# Altium schematic sheet DCDC35V.SchDoc
size 420 x 297 mm; SheetNumber: 6; SheetTotal: 8
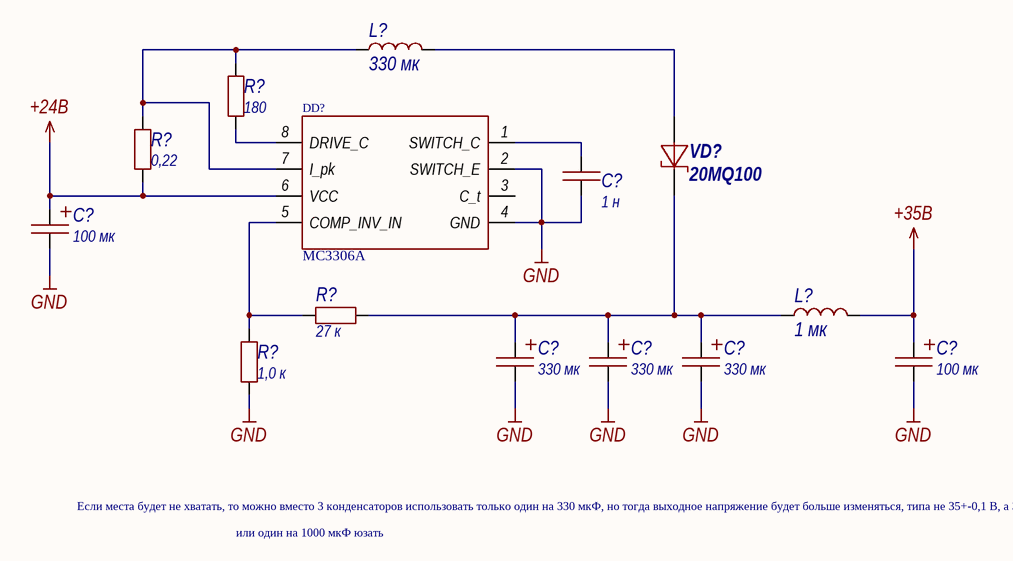
[diagram p0: DCDC35V.SchDoc]

## Parts
(Parts that share a designator on the sheet are numbered #1, #2 ... from top to bottom, then left to right.)
C?#1  value 1 н  [0603C]  (hidden comment: Capacitor)
C?#2  value 100 мк  [ECAP_SMD_6,6x6,6]  (hidden comment: Capacitor)
C?#3  value 330 мк  [ECAP_SMD_10,3x10,3]  (hidden comment: Capacitor)
C?#4  value 330 мк  [ECAP_SMD_10,3x10,3]  (hidden comment: Capacitor)
C?#5  value 330 мк  [ECAP_SMD_10,3x10,3]  (hidden comment: Capacitor)
C?#6  value 100 мк  [ECAP_SMD_6,6x6,6]  (hidden comment: Capacitor)
DD?  MC3306A  [SOIC-8]
L?#1  value 330 мк  [12.8x12.8]  (hidden comment: CDSPRH127-331M)
L?#2  value 1 мк  [4.5x4_wired]  (hidden comment: CDSP43-1R0M)
R?#1  value 0,22  [2512R]  (hidden comment: Resistor)
R?#2  value 180  [0603R]  (hidden comment: Resistor)
R?#3  value 27 к  [0603R]  (hidden comment: Resistor)
R?#4  value 1,0 к  [0603R]  (hidden comment: Resistor)
VD?  20MQ100  [SMA]

## Nets
+24В: C?#2.1 DD?.6(VCC) R?#1.2
+35В: C?#6.1 L?#2.2
GND: C?#1.1 C?#2.2 C?#3.2 C?#4.2 C?#5.2 C?#6.2 DD?.2(SWITCH_E) DD?.4(GND) R?#4.1
NetC?#1_2: C?#1.2 DD?.1(SWITCH_C)
NetC?#3_1: C?#3.1 C?#4.1 C?#5.1 L?#2.1 R?#3.2 VD?.2
NetDD?_5: DD?.5(COMP_INV_IN) R?#3.1 R?#4.2
NetDD?_7: DD?.7(I_pk) L?#1.1 R?#1.1 R?#2.2
NetDD?_8: DD?.8(DRIVE_C) R?#2.1
NetL?#1_2: L?#1.2 VD?.1

Not connected (* = marked no-connect by the designer): DD? 3(C_t)

## Notes on the sheet
- Если места будет не хватать, то можно вместо 3 конденсаторов использовать только один на 330 мкФ, но тогда выходное напряжение будет больше изменяться, типа не 35+-0,1 В, а 35+-0,3 В
- или один на 1000 мкФ юзать
- Перв. примен.
- Справ. №
- Подп. и дата
- Инв. № дубл.
- Взам. инв. №
- Инв. № подл.
- Изм.
- Лист
- № докум.
- Подп.
- Дата
- Копировал
- Формат А3

## Library data of the parts
C?#1 = Capacitor_1n_10_50V_X7R_0603C: Конденсатор; Library Path2: Schematic\Capacitor.SchLib; Tolerance: 0,1; Voltage (V): 50; Dielectric: X7R; Capacity (nF): 1; Part Number: Capacitor_1n_10_50V_X7R_0603C
C?#2 C?#6 = JCK1V101: Конденсатор алюминиевый электролитический 100мкФ 35В 20% SMD 6,6x6,6 мм; Tolerance: 20; Voltage (V): 35; Type: SMD Aluminum; Capacity (uF): 100; Part Number: JCK1V101
C?#3-C?#5 = JCK1V331: Конденсатор алюминиевый электролитический 1000мкФ 25В 20% Low ESR 1100мА SMD12.5x13.5мм; Tolerance: 20; Voltage (V): 35; Type: SMD Aluminum; Capacity (uF): 330; Part Number: JCK1V331
DD? = MC3306A: DC-DC понижающий/повышающий преобразователь, вход: 3 - 40 В, выход: 1,25 - 40 В 1,5 А; Part Number: MC3306A
L?#1 = CDSPRH127-331M: Индуктивность на 330 мкГн, номинальный ток 1,79 A; Inductance (μH): 330; Current (A): 1,79; Part Number: CDSPRH127-331M
L?#2 = CDSP43-1R0M: Индуктивность на 1 мкГн, номинальный ток 4,3 A; Inductance (μH): 1; Current (A): 4,3; Part Number: CDSP43-1R0M
R?#1 = Resistor_0.22_1_2512: Резистор номиналом 0,22 Ом и точностью 1%; Power: *; Part Number: Resistor_0.22_1_2512; Tolerance: 1%
R?#2 = Resistor_180_1_0603: Резистор номиналом 180 Ом и точностью 1%; Power: *; Part Number: Resistor_180_1_0603; Tolerance: 1%
R?#3 = Resistor_27k_1_0603: Резистор номиналом 27 кОм и точностью 1%; Power: *; Part Number: Resistor_27k_1_0603; Tolerance: 1%
R?#4 = Resistor_1.0k_1_0603: Резистор номиналом 1,0 кОм и точностью 1%; Power: *; Part Number: Resistor_1.0k_1_0603; Tolerance: 1%
VD? = 20MQ100: Диод шоттки на 100 В, ном. ток 2 А; Voltage nominal (V): 100; Current (A): 2; Part Number: 20MQ100